# Altium schematic sheet Slave_Block.SchDoc: Slave Block Diagram
size A4; Organization: University of Colorado; Address1: Boulder; Address2: Bhishma; Address3: Low Power Embedded; Address4: Design Techniques; SheetNumber: 3; SheetTotal: 9
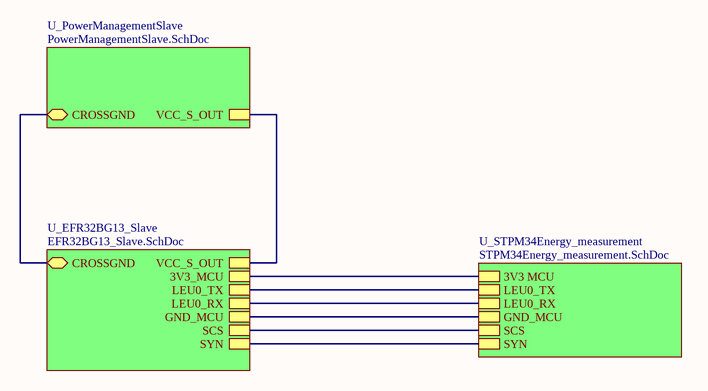
[diagram p0: Slave_Block.SchDoc]

## Sub-sheets
U_EFR32BG13_Slave = EFR32BG13_Slave.SchDoc: LEU0_TX, LEU0_RX, SCS, SYN, GND_MCU, 3V3_MCU, VCC_S_OUT, CROSSGND
U_PowerManagementSlave = PowerManagementSlave.SchDoc: VCC_S_OUT, CROSSGND
U_STPM34Energy_measurement = STPM34Energy_measurement.SchDoc: 3V3 MCU, LEU0_TX, LEU0_RX, GND_MCU, SCS, SYN

## Nets
(unnamed): sheet U_EFR32BG13_Slave/LEU0_TX, sheet U_STPM34Energy_measurement/LEU0_TX
(unnamed): sheet U_EFR32BG13_Slave/LEU0_RX, sheet U_STPM34Energy_measurement/LEU0_RX
(unnamed): sheet U_EFR32BG13_Slave/SCS, sheet U_STPM34Energy_measurement/SCS
(unnamed): sheet U_EFR32BG13_Slave/SYN, sheet U_STPM34Energy_measurement/SYN
(unnamed): sheet U_EFR32BG13_Slave/GND_MCU, sheet U_STPM34Energy_measurement/GND_MCU
(unnamed): sheet U_EFR32BG13_Slave/3V3_MCU, sheet U_STPM34Energy_measurement/3V3 MCU
(unnamed): sheet U_EFR32BG13_Slave/VCC_S_OUT, sheet U_PowerManagementSlave/VCC_S_OUT
(unnamed): sheet U_EFR32BG13_Slave/CROSSGND, sheet U_PowerManagementSlave/CROSSGND

## Notes on the sheet
- Title
- Size:
- Date:
- A4
- Number:
- Time:
- Revision:
- Sheet
- of
- File: